# EasyEDA schematic SCH_VU Meter Deck_2023-07-02.json

## Sheets
1 VU Meter Deck Driver: TITLE: VU Meter Deck Driver; REV: 1.0; Date: 2023-02-28; Sheet: 1/2; Drawn By: Szymon Bartosik
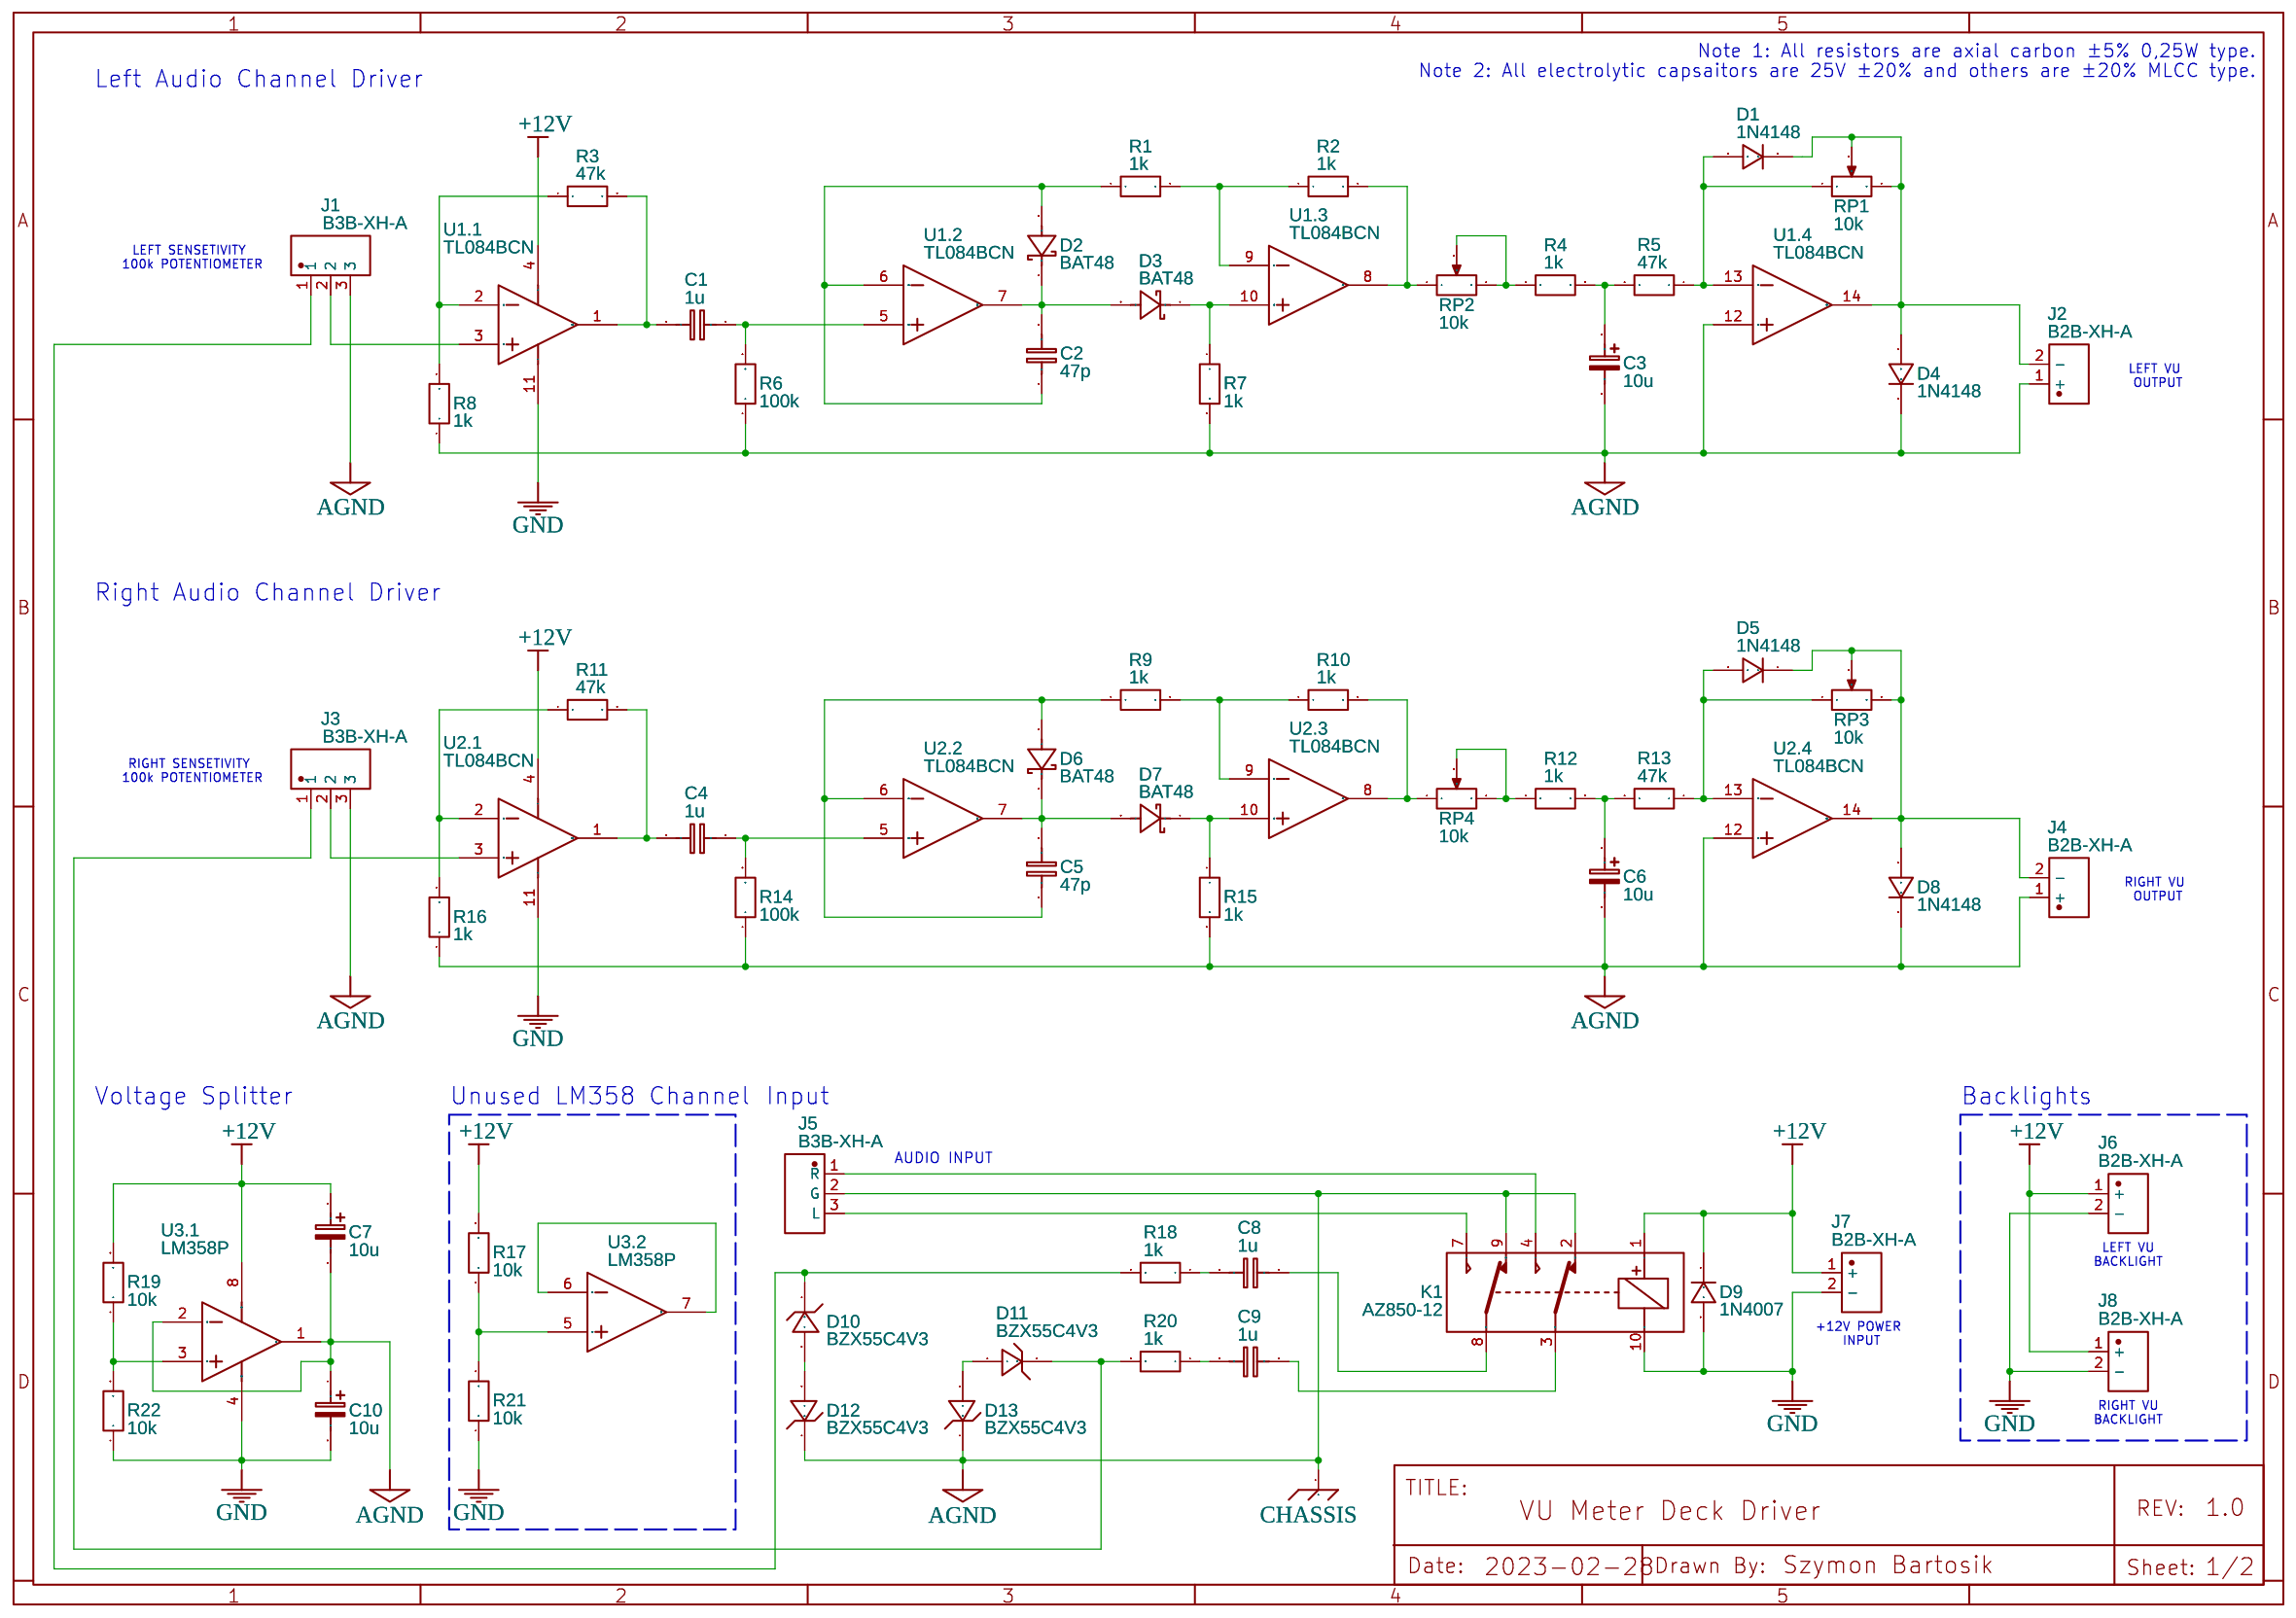
[diagram p0: VU Meter Deck Driver]
2 VU Meter Deck Wiring Diagram: TITLE: VU Meter Deck Wiring Diagram; Sheet: 2/2
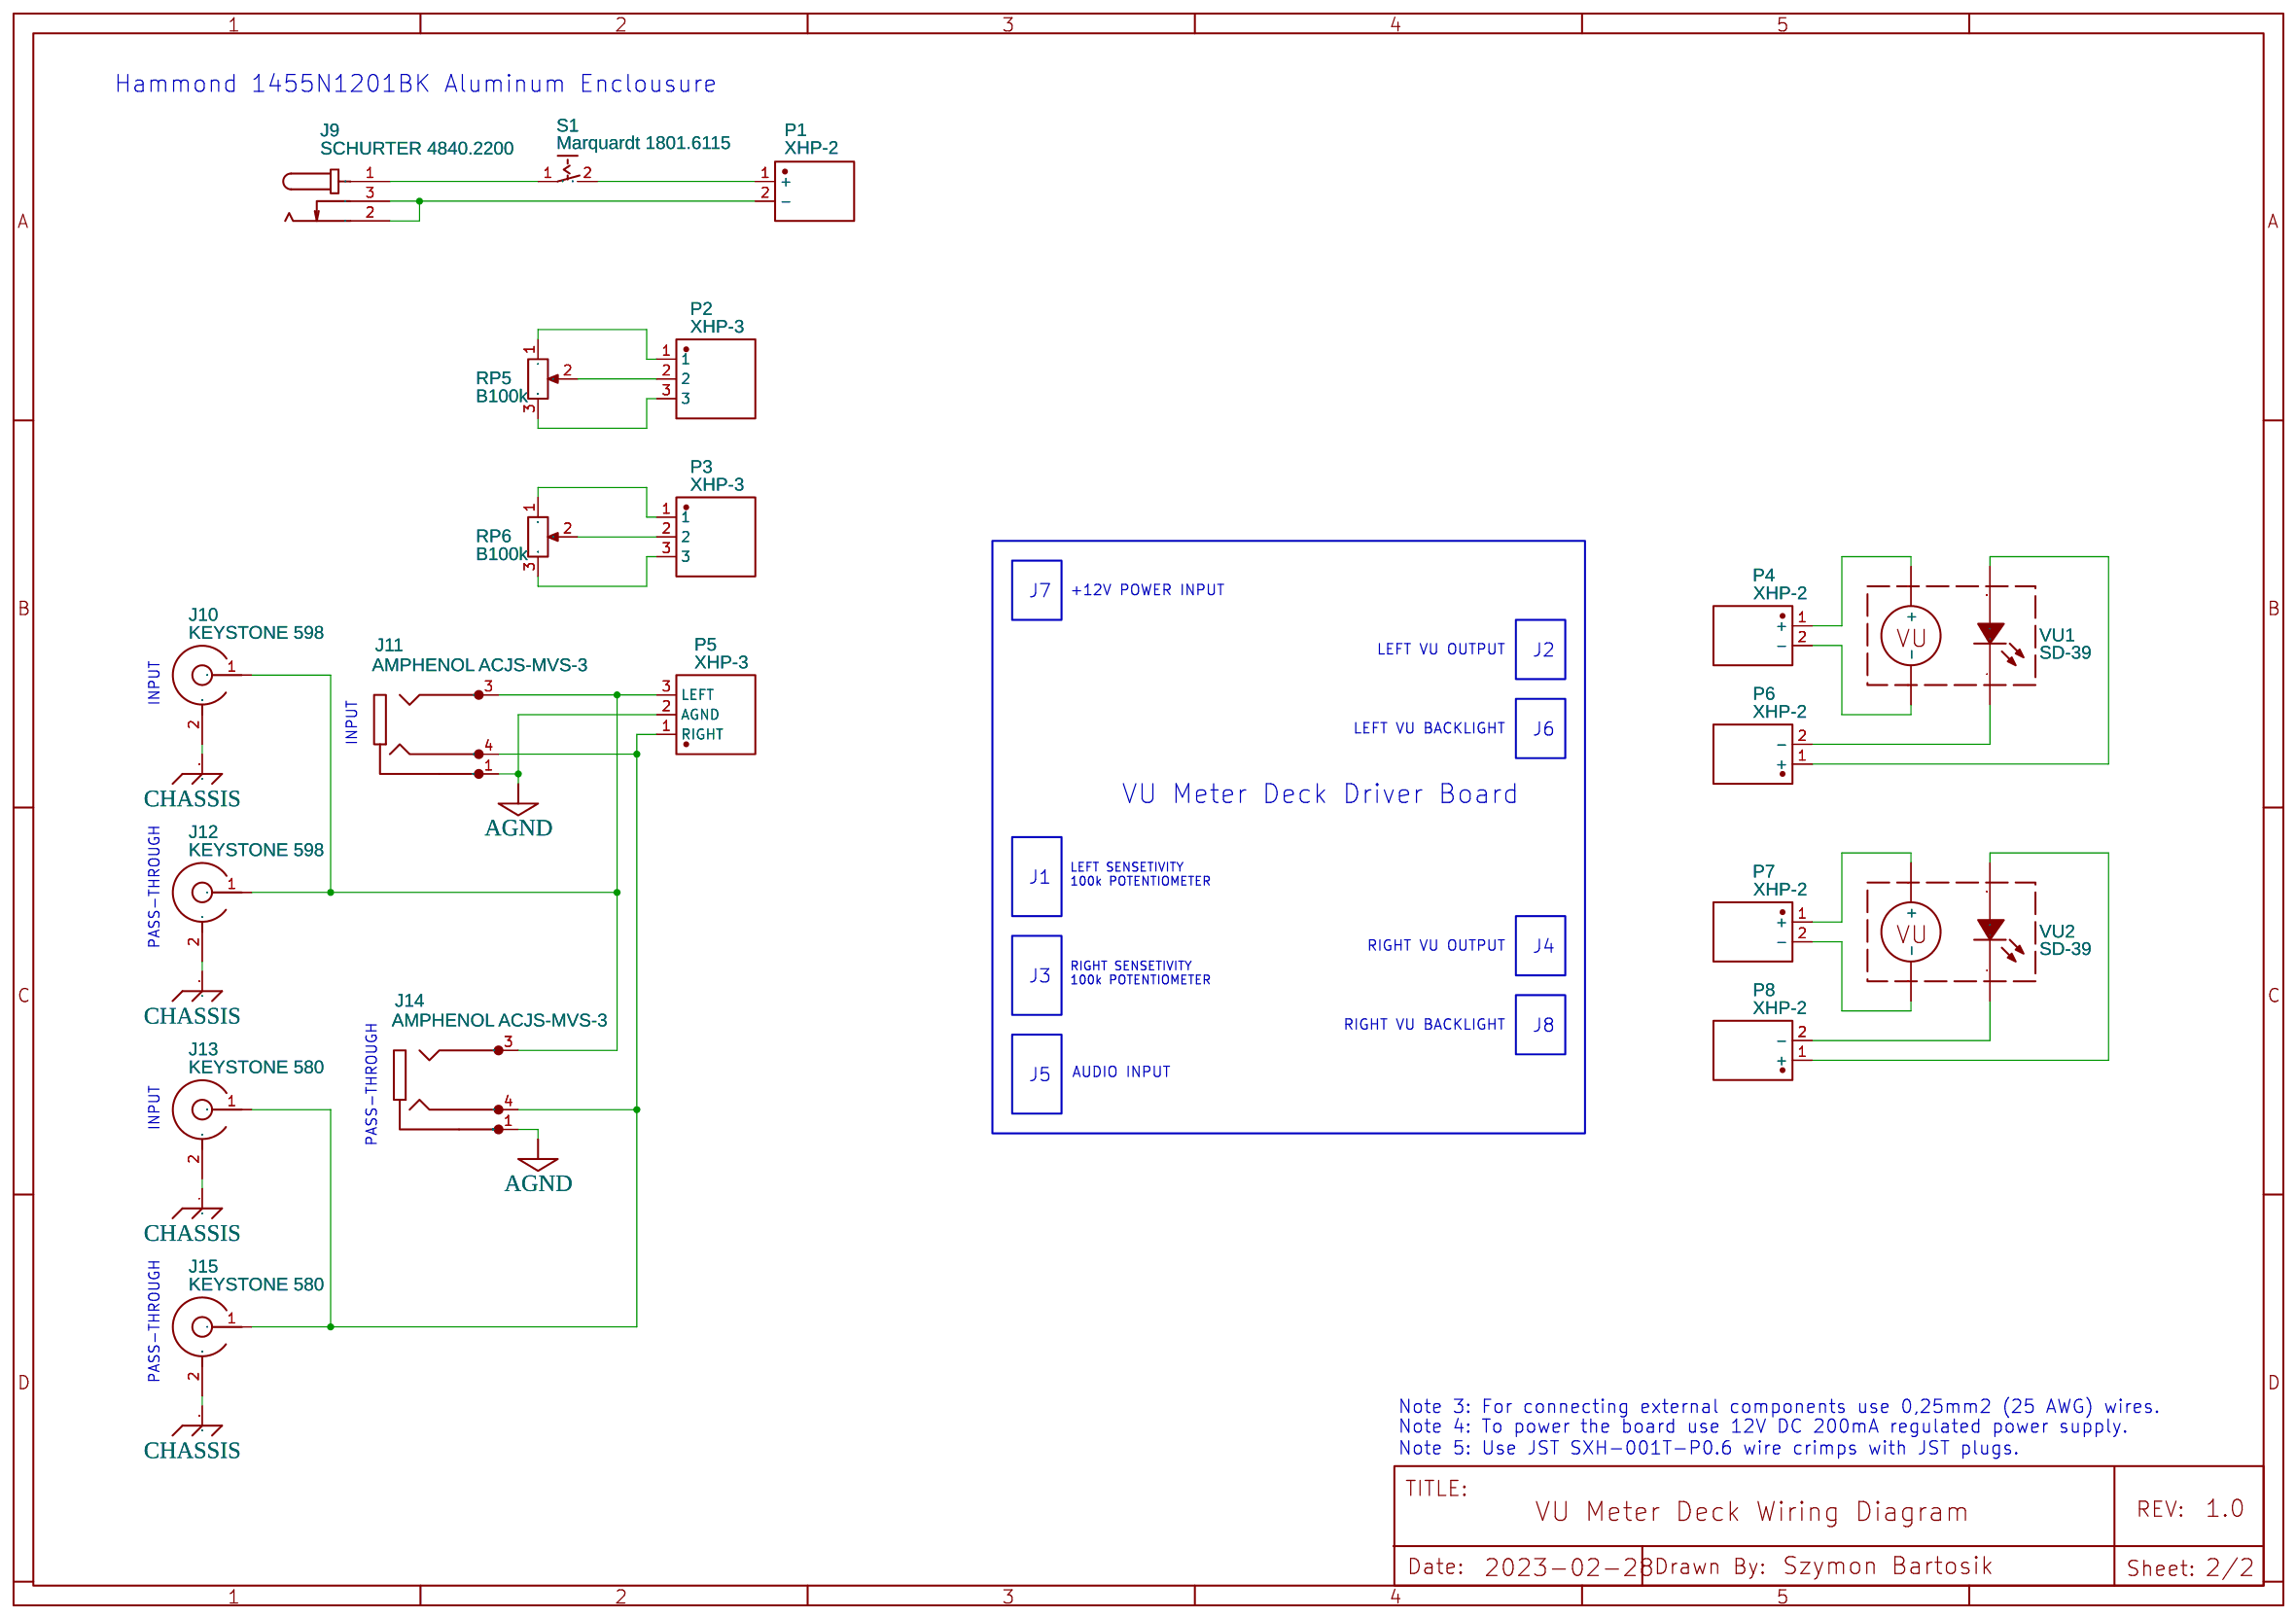
[diagram p1: VU Meter Deck Wiring Diagram]

## Parts
sheet VU Meter Deck Driver
C1  1u  [RAD-0.2]
C2  47p  [RAD-0.2]
C3  10u  [CAP-D5.0×F2.0]
C4  1u  [RAD-0.2]
C5  47p  [RAD-0.2]
C6  10u  [CAP-D5.0×F2.0]
C7  10u  [CAP-D5.0×F2.0]
C8  1u  [RAD-0.2]
C9  1u  [RAD-0.2]
C10  10u  [CAP-D5.0×F2.0]
CHASSIS1  CHASSIS
D1  1N4148  [DO-35_BD2.0-L4.2-P8.20-D0.5-RD]
D2  BAT48  [DO-35_BD2.0-L4.2-P8.20-D0.5-RD]
D3  BAT48  [DO-35_BD2.0-L4.2-P8.20-D0.5-RD]
D4  1N4148  [DO-35_BD2.0-L4.2-P8.20-D0.5-RD]
D5  1N4148  [DO-35_BD2.0-L4.2-P8.20-D0.5-RD]
D6  BAT48  [DO-35_BD2.0-L4.2-P8.20-D0.5-RD]
D7  BAT48  [DO-35_BD2.0-L4.2-P8.20-D0.5-RD]
D8  1N4148  [DO-35_BD2.0-L4.2-P8.20-D0.5-RD]
D9  1N4007  [DO-41_BD2.4-L4.7-P8.70-D0.9-RD]
D10  BZX55C4V3  [DO-35_BD2.0-L4.0-P8.00-D0.5-FD]
D11  BZX55C4V3  [DO-35_BD2.0-L4.0-P8.00-D0.5-FD]
D12  BZX55C4V3  [DO-35_BD2.0-L4.0-P8.00-D0.5-FD]
D13  BZX55C4V3  [DO-35_BD2.0-L4.0-P8.00-D0.5-FD]
J1  B3B-XH-A  [CONN-TH_3P-P2.50_B3B-XH-A-BK-LF-SN]
J2  B2B-XH-A  [CONN-TH_2P-P2.50_JST_B2B-XH-A-M]
J3  B3B-XH-A  [CONN-TH_3P-P2.50_B3B-XH-A-BK-LF-SN]
J4  B2B-XH-A  [CONN-TH_2P-P2.50_JST_B2B-XH-A-M]
J5  B3B-XH-A  [CONN-TH_3P-P2.50_B3B-XH-A-BK-LF-SN]
J6  B2B-XH-A  [CONN-TH_2P-P2.50_JST_B2B-XH-A-M]
J7  B2B-XH-A  [CONN-TH_2P-P2.50_JST_B2B-XH-A-M]
J8  B2B-XH-A  [CONN-TH_2P-P2.50_JST_B2B-XH-A-M]
K1  AZ850-12  [AZ850]
R1  1k  [R_AXIAL-0.4]
R2  1k  [R_AXIAL-0.4]
R3  47k  [R_AXIAL-0.4]
R4  1k  [R_AXIAL-0.4]
R5  47k  [R_AXIAL-0.4]
R6  100k  [R_AXIAL-0.4]
R7  1k  [R_AXIAL-0.4]
R8  1k  [R_AXIAL-0.4]
R9  1k  [R_AXIAL-0.4]
R10  1k  [R_AXIAL-0.4]
R11  47k  [R_AXIAL-0.4]
R12  1k  [R_AXIAL-0.4]
R13  47k  [R_AXIAL-0.4]
R14  100k  [R_AXIAL-0.4]
R15  1k  [R_AXIAL-0.4]
R16  1k  [R_AXIAL-0.4]
R17  10k  [R_AXIAL-0.4]
R18  1k  [R_AXIAL-0.4]
R19  10k  [R_AXIAL-0.4]
R20  1k  [R_AXIAL-0.4]
R21  10k  [R_AXIAL-0.4]
R22  10k  [R_AXIAL-0.4]
RP1  10k  [RES-ADJ-TH_3296W]
RP2  10k  [RES-ADJ-TH_3296W]
RP3  10k  [RES-ADJ-TH_3296W]
RP4  10k  [RES-ADJ-TH_3296W]
U1  TL084BCN  [PDIP-14]  (sections 1,2,3,4)
U2  TL084BCN  [PDIP-14]  (sections 1,2,3,4)
U3  LM358P  [PDIP-8_L9.6-W6.4-P2.54-LS7.6-BL]  (sections 1,2)
sheet VU Meter Deck Wiring Diagram
CHASSIS2  CHASSIS
CHASSIS3  CHASSIS
CHASSIS4  CHASSIS
CHASSIS5  CHASSIS
J9  SCHURTER 4840.2200
J10  KEYSTONE 598
J11  AMPHENOL ACJS-MVS-3
J12  KEYSTONE 598
J13  KEYSTONE 580
J14  AMPHENOL ACJS-MVS-3
J15  KEYSTONE 580
P1  XHP-2
P2  XHP-3
P3  XHP-3
P4  XHP-2
P5  XHP-3
P6  XHP-2
P7  XHP-2
P8  XHP-2
RP5  B100k
RP6  B100k
S1  Marquardt 1801.6115
VU1  SD-39
VU2  SD-39

## Library data of the parts
C1 C4 C8 C9 = C_RAD-0.1_EU: Supplier Part: CCT-1U/50V; Supplier: TME; Contributor: LCEDA_Lib; Manufacturer Part: CT40805Y105M500F3R; Manufacturer: SR PASSIVES
C2 C5 = C_RAD-0.2_EU: Supplier Part: CC-47/100; Supplier: TME; Contributor: LCEDA_Lib; Manufacturer Part: CC-47/100; Manufacturer: SR PASSIVES
C3 C6 C7 C10 = CE_TH_D5.0×F2.0_EU: Contributor: LCEDA_Lib; Supplier Part: SD1E106M05011BB; Supplier: TME; Manufacturer Part: SD1E106M05011BB; Manufacturer: SAMWHA
D1 D4 D5 D8 = 1N4148: Supplier: TME; Supplier Part: 1N4148-DIO; Manufacturer: DIOTEC SEMICONDUCTOR; Contributor: LCSC
D2 D3 D6 D7 = BAT48ZFILM: Supplier: TME; Manufacturer: STMicroelectronics; Contributor: lcsc
D9 = 1N4007: Supplier: TME; Manufacturer: DC COMPONENTS; Supplier Part: 1N4007-DC; Contributor: LCEDA_Lib; Package Display: No
D10-D13 = BZX85C15: Supplier: TME; Supplier Part: BZX55C4V3-TAP; Manufacturer: VISHAY; Manufacturer Part: BZX55C4V3-TAP; Contributor: lcsc
J1 J3 J5 = B3B-XH-A-BK(LF)(SN): Supplier: TME; Manufacturer: JST; Contributor: LCSC
J2 J4 J6-J8 = B2B-XH-A-M(LF)(SN)(P): Supplier: TME; Manufacturer: JST; Contributor: lcsc
K1 = AZ850-12: Supplier: TME; Manufacturer: ZETTLER
R1 R2 R4 R7-R10 R12 R15 R16 R18 R20 = R_AXIAL-0.4_EU: Supplier Part: CF1/4W-1K; Supplier: TME; Contributor: LCEDA_Lib; Manufacturer Part: CF1/4W-1K; Manufacturer: SR PASSIVES
R3 R5 R11 R13 = R_AXIAL-0.4_EU: Supplier Part: CF1/4W-47K; Supplier: TME; Contributor: LCEDA_Lib; Manufacturer Part: CF1/4W-47K; Manufacturer: SR PASSIVES
R6 R14 = R_AXIAL-0.4_EU: Supplier Part: CF1/4W-100K; Supplier: TME; Contributor: LCEDA_Lib; Manufacturer Part: CF1/4W-100K; Manufacturer: SR PASSIVES
R17 R19 R21 R22 = R_AXIAL-0.4_EU: Supplier Part: CF1/4W-10K; Supplier: TME; Contributor: LCEDA_Lib; Manufacturer Part: CF1/4W-10K; Manufacturer: SR PASSIVES
RP1-RP4 = R_3386P_EU: Supplier Part: T910W-10K; Supplier: TME; Manufacturer Part: T910W-10K; Contributor: LCEDA_Lib; Manufacturer: SR PASSIVES
U1 U2 = TL084HIDR: Supplier: TME; Manufacturer: Texas Instruments; subpart_no: 1
U3 = LM358P_C5330384: Supplier: TME; Manufacturer: Texas Instruments; subpart_no: 1
J9 = DC005-2.0MM: Supplier: TME; Manufacturer: SCHURTER; Manufacturer Part: 4840.2200; Supplier Part: 4840.2200
J10 J12 = RCA cinch: Manufacturer: KEYSTONE; Manufacturer Part: 598; Supplier Part: KEYS598; Supplier: TME; Contributor: Mauro Fikon
J11 J14 = ACJS-MV-3: Manufacturer Part: ACJS-MVS-3; Contributor: Eric Toussaint; Supplier: TME; Supplier Part: ACJS-MVS-3; Manufacturer: AMPHENOL
J13 J15 = RCA cinch: Manufacturer: KEYSTONE; Manufacturer Part: 580; Supplier Part: KEYS580; Supplier: TME; Contributor: Mauro Fikon
P1 P4 P6-P8 = S2B-XH-A-1 (LF)(SN): Supplier: TME; Manufacturer: JST; Contributor: LCSC
P2 P3 P5 = S3B-XH-A-1 (LF)(SN): Supplier: TME; Manufacturer: JST; Contributor: LCSC
RP5 RP6 = R_3386P_EU: Supplier Part: R16148-1A-1-B100K; Supplier: TME; Manufacturer Part: R16148-1A-1-B100K; Contributor: LCEDA_Lib; Manufacturer: SR PASSIVES
S1 = SPST Bistable Rocker Switch: Manufacturer: Marquardt; Manufacturer Part: 1801.6115; Supplier Part: 1801.6115; Supplier: TME; Contributor: Szymon Bartosik
VU1 VU2 = SD-39: Contributor: szymon.bartosik75

## Nets
+12V: C7.1 D9.1 J6.1(+) J7.1(+) J8.1(+) K1.1 R17.2 R19.2 U1.4(V+) U2.4(V+) U3.8(VCC)
AGND: C3.2 C6.2 C7.2 C10.1 CHASSIS1.1 D4.1 D8.1 D12.1(C) D13.1(C) J1.3 J2.1(+) J3.3 J4.1(+) J5.2(G) J11.1(SLEEVE) J14.1(SLEEVE) K1.2 K1.9 P5.2(AGND) R6.1 R7.2 R8.1 R14.1 R15.2 R16.1 U1.12(+IND) U2.12(+IND) U3.1(OUT1) U3.2(IN1-)
GND: C10.2 D9.2 J6.2(-) J7.2(-) J8.2(-) K1.10 R21.1 R22.1 U1.11(V-) U2.11(V-) U3.4(GND)
Net-(C1-1): C1.1 R6.2 U1.5(+INB)
Net-(C1-2): C1.2 R3.2 U1.1(OUTA)
Net-(C2-1): C2.1 D2.2(A) R1.1 U1.6(-INB)
Net-(C2-2): C2.2 D2.1(K) D3.2(A) U1.7(OUTB)
Net-(C3-1): C3.1 R4.2 R5.2
Net-(C4-1): C4.1 R14.2 U2.5(+INB)
Net-(C4-2): C4.2 R11.2 U2.1(OUTA)
Net-(C5-1): C5.1 D6.2(A) R9.1 U2.6(-INB)
Net-(C5-2): C5.2 D6.1(K) D7.2(A) U2.7(OUTB)
Net-(C6-1): C6.1 R12.2 R13.2
Net-(C8-1): C8.1 K1.8
Net-(C8-2): C8.2 R18.1
Net-(C9-1): C9.1 K1.3
Net-(C9-2): C9.2 R20.1
Net-(CHASSIS2-1): CHASSIS2.1 J10.2
Net-(CHASSIS3-1): CHASSIS3.1 J12.2
Net-(CHASSIS4-1): CHASSIS4.1 J13.2
Net-(CHASSIS5-1): CHASSIS5.1 J15.2
Net-(D1-1): D1.1 D4.2 J2.2(-) RP1.2 RP1.3 U1.14(OUTD)
Net-(D1-2): D1.2 R5.1 RP1.1 U1.13(-IND)
Net-(D3-1): D3.1(K) R7.1 U1.10(+INC)
Net-(D5-1): D5.1 D8.2 J4.2(-) RP3.2 RP3.3 U2.14(OUTD)
Net-(D5-2): D5.2 R13.1 RP3.1 U2.13(-IND)
Net-(D7-1): D7.1(K) R15.1 U2.10(+INC)
Net-(D10-1): D10.1(C) J1.1 R18.2
Net-(D10-2): D10.2(A) D12.2(A)
Net-(D11-1): D11.1(C) J3.1 R20.2
Net-(D11-2): D11.2(A) D13.2(A)
Net-(J1-2): J1.2 U1.3(+INA)
Net-(J3-2): J3.2 U2.3(+INA)
Net-(J5-1): J5.1(R) K1.4
Net-(J5-3): J5.3(L) K1.7
Net-(J9-1): J9.1 S1.1
Net-(J9-2): J9.2 J9.3 P1.2(-)
Net-(J10-1): J10.1 J11.3(TIP) J12.1 J14.3(TIP) P5.3(LEFT)
Net-(J11-4): J11.4(TIP) J13.1 J14.4(TIP) J15.1 P5.1(RIGHT)
Net-(P1-1): P1.1(+) S1.2
Net-(P2-1): P2.1 RP5.1
Net-(P2-2): P2.2 RP5.2
Net-(P2-3): P2.3 RP5.3
Net-(P3-1): P3.1 RP6.1
Net-(P3-2): P3.2 RP6.2
Net-(P3-3): P3.3 RP6.3
Net-(P4-1): P4.1(+) VU1.1(+)
Net-(P4-2): P4.2(-) VU1.2(-)
Net-(P6-1): P6.1(+) VU1.3(+)
Net-(P6-2): P6.2(-) VU1.4(-)
Net-(P7-1): P7.1(+) VU2.1(+)
Net-(P7-2): P7.2(-) VU2.2(-)
Net-(P8-1): P8.1(+) VU2.3(+)
Net-(P8-2): P8.2(-) VU2.4(-)
Net-(R1-2): R1.2 R2.1 U1.9(-INC)
Net-(R2-2): R2.2 RP2.1 U1.8(OUTC)
Net-(R3-1): R3.1 R8.2 U1.2(-INA)
Net-(R4-1): R4.1 RP2.2 RP2.3
Net-(R9-2): R9.2 R10.1 U2.9(-INC)
Net-(R10-2): R10.2 RP4.1 U2.8(OUTC)
Net-(R11-1): R11.1 R16.2 U2.2(-INA)
Net-(R12-1): R12.1 RP4.2 RP4.3
Net-(R17-1): R17.1 R21.2 U3.5(IN2+)
Net-(R19-1): R19.1 R22.2 U3.3(IN1+)
Net-(U3.2-6): U3.6(IN2-) U3.7(OUT2)

## Notes on the sheets
sheet 1
- Note 1: All resistors are axial carbon ±5% 0,25W type.
- Note 2: All electrolytic capsaitors are 25V ±20% and others are ±20% MLCC type.
- Left Audio Channel Driver
- LEFT SENSETIVITY
  100k POTENTIOMETER
- LEFT VU
  OUTPUT
- Right Audio Channel Driver
- RIGHT SENSETIVITY
  100k POTENTIOMETER
- RIGHT VU
  OUTPUT
- Voltage Splitter
- Unused LM358 Channel
- Input
- Backlights
- AUDIO INPUT
- LEFT VU
  BACKLIGHT
- +12V POWER
  INPUT
- RIGHT VU
  BACKLIGHT
sheet 2
- Hammond 1455N1201BK Aluminum Enclousure
- J7
- +12V POWER INPUT
- LEFT VU OUTPUT
- J2
- INPUT
- LEFT VU BACKLIGHT
- J6
- INPUT
- VU Meter Deck Driver Board
- LEFT SENSETIVITY
  100k POTENTIOMETER
- J1
- PASS-THROUGH
- RIGHT VU OUTPUT
- J4
- J3
- RIGHT SENSETIVITY
  100k POTENTIOMETER
- RIGHT VU BACKLIGHT
- J8
- J5
- AUDIO INPUT
- INPUT
- PASS-THROUGH
- PASS-THROUGH
- Note 3: For connecting external components use 0,25mm2 (25 AWG) wires.
- Note 4: To power the board use 12V DC 200mA regulated power supply.
- Note 5: Use JST SXH-001T-P0.6 wire crimps with JST plugs.
